# Altium schematic sheet Ampli4.SchDoc
size A4
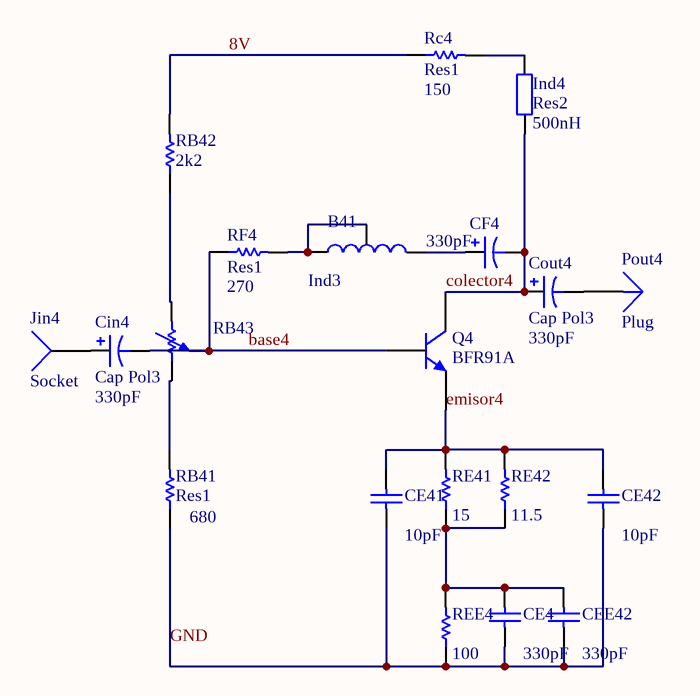
[diagram p0: Ampli4.SchDoc]

## Parts
B41  Ind3  [Ind 7mm]
CE4  value 330pF  [1608[0603]]  (hidden comment: Cap Semi)
CE41  value 10pF  [1608[0603]]  (hidden comment: Cap Semi)
CE42  value 10pF  [1608[0603]]  (hidden comment: Cap Semi)
CEE42  value 330pF  [1608[0603]]  (hidden comment: Cap Semi)
CF4  value 330pF  [C0805]  (hidden comment: Cap Pol3)
Cin4  Cap Pol3  value 330pF  [C0805]
Cout4  Cap Pol3  value 330pF  [C0805]
Ind4  Res2  value 500nH  [AXIAL-0.4]
Jin4  Socket  [PIN1]
Pout4  Plug  [PIN1]
Q4  BFR91A  [SOT-37_short]
RB41  Res1  value 680  [AXIAL-0.3]
RB42  value 2k2  [AXIAL-0.3]  (hidden comment: Res1)
RB43  Pot  [Potenciometro]  (value not drawn)
Rc4  Res1  value 150  [AXIAL-0.3]
RE41  value 15  [1608[0603]]  (hidden comment: Res Semi)
RE42  value 11.5  [2012[0805]]  (hidden comment: Res Semi)
REE4  value 100  [2012[0805]]  (hidden comment: Res Semi)
RF4  Res1  value 270  [AXIAL-0.3]

## Nets
8V: RB42.2 Rc4.1
base4: Cin4.2 Q4.0(B) RB43.3 RF4.1
colector4: CF4.2 Cout4.1 Ind4.1 Q4.2(C)
emisor4: CE41.2 CE42.2 Q4.1(E) RE41.2 RE42.2
GND: CE4.1 CE41.1 CE42.1 CEE42.1 RB41.1 REE4.1
NetB41_0: B41.0 B41.2 RF4.2
NetB41_1: B41.1 CF4.1
NetCE4_2: CE4.2 CEE42.2 RE41.1 RE42.1 REE4.2
NetCin4_1: Cin4.1 Jin4.1
NetCout4_2: Cout4.2 Pout4.1
NetInd4_2: Ind4.2 Rc4.2
NetRB41_2: RB41.2 RB43.2
NetRB42_1: RB42.1 RB43.1

## Library data of the parts
CE4 CE41 CE42 CEE42 = Cap Semi: Capacitor (Semiconductor SIM Model); Published: 8-Jun-2000; LatestRevisionDate: 17-Jul-2002; LatestRevisionNote: Re-released for DXP Platform.; PackageReference: C1206; Publisher: Altium Limited
CF4 Cin4 Cout4 = Cap Pol3: Polarized Capacitor (Surface Mount); Published: 8-Jun-2000; LatestRevisionDate: 17-Jul-2002; LatestRevisionNote: Re-released for DXP Platform.; PackageReference: C0805; Publisher: Altium Limited
Ind4 = Res2: Resistor; Published: 8-Jun-2000; LatestRevisionDate: 17-Jul-2002; LatestRevisionNote: Re-released for DXP Platform.; PackageReference: AXIAL-0.4; Publisher: Altium Limited
Q4 = BFR92A: NPN 5 GHz Wideband Transistor; Published: 17-Sep-2003; DatasheetDocument: 29-Oct-1997; PackageDocument: May-1999; PackageReference: SOT23; Publisher: Altium Limited; ComponentLink1Description: Manufacturer Link; ComponentLink1URL: http://www.semiconductors.philips.com/; ComponentLink2Description: Datasheet; ComponentLink2URL: http://www.semiconductors.philips.com/acrobat/datasheets/BFR92A_2.pdf
RB41 RB42 Rc4 RF4 = Res1: Resistor; Published: 8-Jun-2000; LatestRevisionDate: 17-Jul-2002; LatestRevisionNote: Re-released for DXP Platform.; PackageReference: AXIAL-0.3; Publisher: Altium Limited
RE41 RE42 REE4 = Res Semi: Semiconductor Resistor; Published: 8-Jun-2000; LatestRevisionDate: 17-Jul-2002; LatestRevisionNote: Re-released for DXP Platform.; PackageReference: AXIAL-0.5; Publisher: Altium Limited
Jin4 = Socket: LatestRevisionDate: 17-Jul-2002; LatestRevisionNote: Re-released for DXP Platform.; Publisher: Altium Limited
Pout4 = Plug: LatestRevisionDate: 17-Jul-2002; LatestRevisionNote: Re-released for DXP Platform.; Publisher: Altium Limited